# Altium schematic sheet drive_logic.SchDoc
size A4
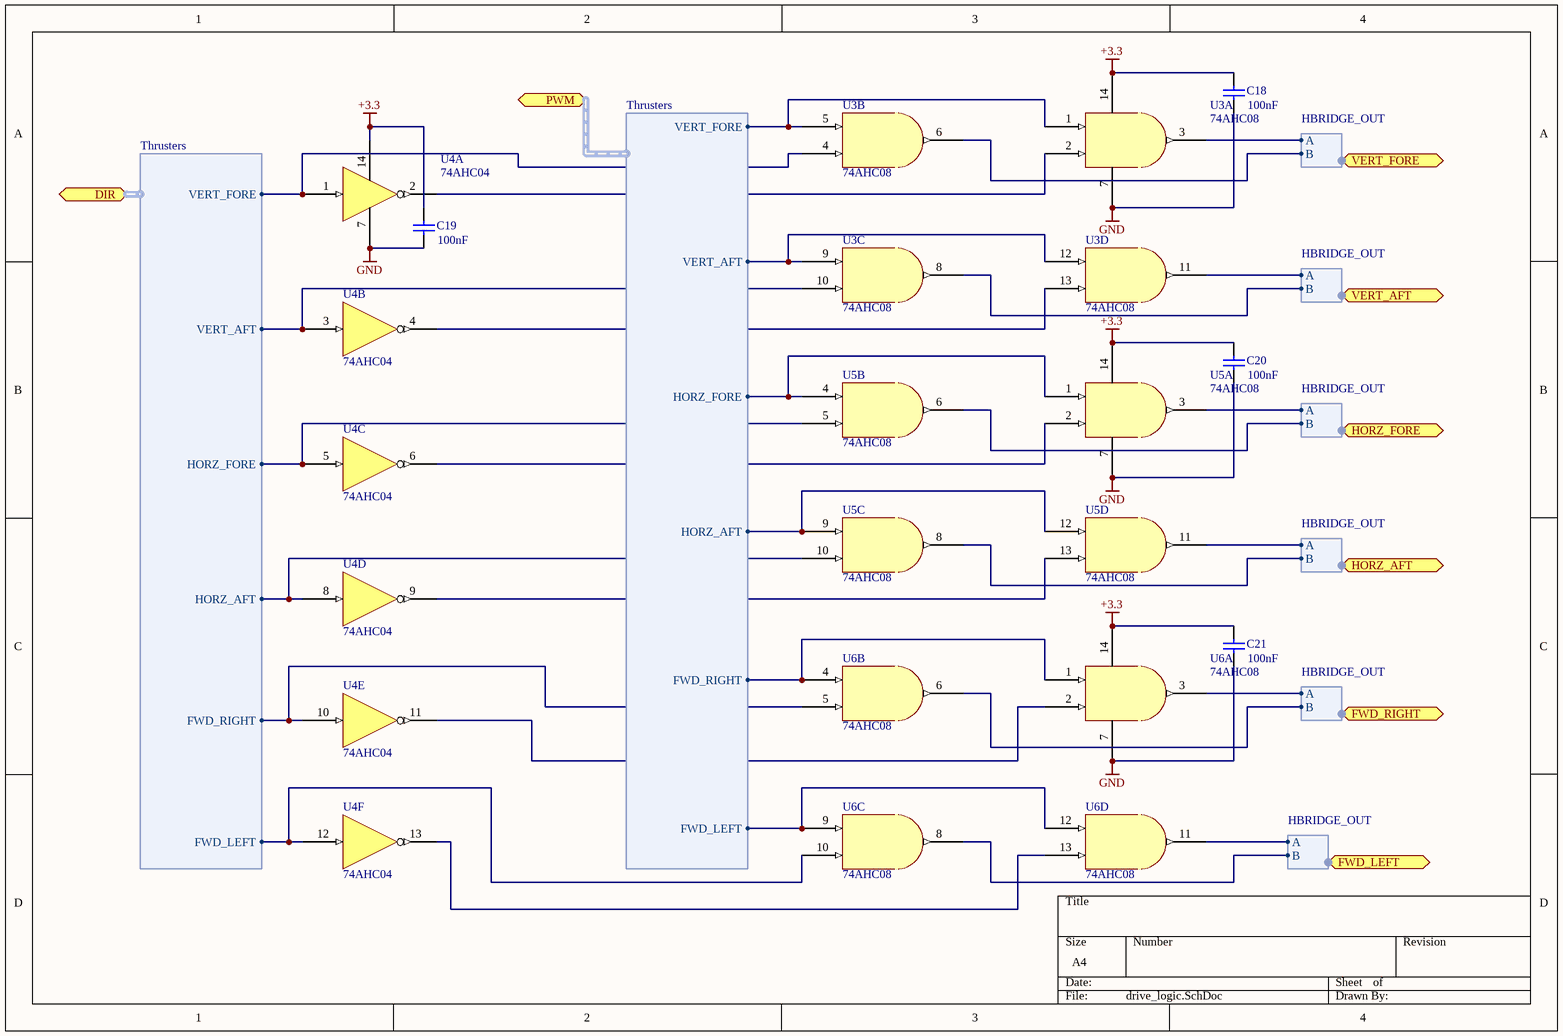
[diagram p0: drive_logic.SchDoc]

## Parts
C18  value 100nF  [C0603]  (hidden comment: Cap)
C19  value 100nF  [C0603]  (hidden comment: Cap)
C20  value 100nF  [C0603]  (hidden comment: Cap)
C21  value 100nF  [C0603]  (hidden comment: Cap)
U3  74AHC08  (parts A,B,C,D of 4)
U4  74AHC04  (parts A,B,C,D,E,F of 6)
U5  74AHC08  (parts A,B,C,D of 4)
U6  74AHC08  (parts A,B,C,D of 4)

## Ports
DIR (harness Thrusters), FWD_LEFT (harness HBRIDGE_OUT), FWD_RIGHT (harness HBRIDGE_OUT), HORZ_AFT (harness HBRIDGE_OUT), HORZ_FORE (harness HBRIDGE_OUT), PWM (harness Thrusters), VERT_AFT (harness HBRIDGE_OUT), VERT_FORE (harness HBRIDGE_OUT)

## Harnesses
Thrusters: FWD_LEFT, FWD_RIGHT, HORZ_AFT, HORZ_FORE, VERT_AFT, VERT_FORE
HBRIDGE_OUT: A, B

## Nets
+3.3: C18.2 C19.2 C20.2 C21.2 U3.14 U4.14 U5.14 U6.14
GND: C18.1 C19.1 C20.1 C21.1 U3.7 U4.7 U5.7 U6.7
NetU3_1: U3.1 U3.5 ; port PWM.VERT_FORE
NetU3_2: U3.2 U4.2
NetU3_3: U3.3 ; port VERT_FORE.A
NetU3_4: U3.4 U4.1 ; port DIR.VERT_FORE
NetU3_6: U3.6 ; port VERT_FORE.B
NetU3_8: U3.8 ; port VERT_AFT.B
NetU3_9: U3.9 U3.12 ; port PWM.VERT_AFT
NetU3_10: U3.10 U4.3 ; port DIR.VERT_AFT
NetU3_11: U3.11 ; port VERT_AFT.A
NetU3_13: U3.13 U4.4
NetU4_5: U4.5 U5.5 ; port DIR.HORZ_FORE
NetU4_6: U4.6 U5.2
NetU4_8: U4.8 U5.10 ; port DIR.HORZ_AFT
NetU4_9: U4.9 U5.13
NetU4_10: U4.10 U6.5 ; port DIR.FWD_RIGHT
NetU4_11: U4.11 U6.2
NetU4_12: U4.12 U6.10 ; port DIR.FWD_LEFT
NetU4_13: U4.13 U6.13
NetU5_1: U5.1 U5.4 ; port PWM.HORZ_FORE
NetU5_3: U5.3 ; port HORZ_FORE.A
NetU5_6: U5.6 ; port HORZ_FORE.B
NetU5_8: U5.8 ; port HORZ_AFT.B
NetU5_9: U5.9 U5.12 ; port PWM.HORZ_AFT
NetU5_11: U5.11 ; port HORZ_AFT.A
NetU6_1: U6.1 U6.4 ; port PWM.FWD_RIGHT
NetU6_3: U6.3 ; port FWD_RIGHT.A
NetU6_6: U6.6 ; port FWD_RIGHT.B
NetU6_8: U6.8 ; port FWD_LEFT.B
NetU6_9: U6.9 U6.12 ; port PWM.FWD_LEFT
NetU6_11: U6.11 ; port FWD_LEFT.A

## Library data of the parts
C18-C21 = Cap: Capacitor; Published: 8-Jun-2000; LatestRevisionDate: 17-Jul-2002; LatestRevisionNote: Re-released for DXP Platform.; PackageReference: RAD-0.3; Publisher: Altium Limited; PackageDescription: Radial Cap, Thru-Hole; 2 Leads; 0.3 in Pin Spacing
U3 U5 U6 = 74AHC08: TTL Quad AND gate
U4 = 74AHC04: TTL Hex inverter